# EAGLE schematic Dash (EAGLE 9.1.1)
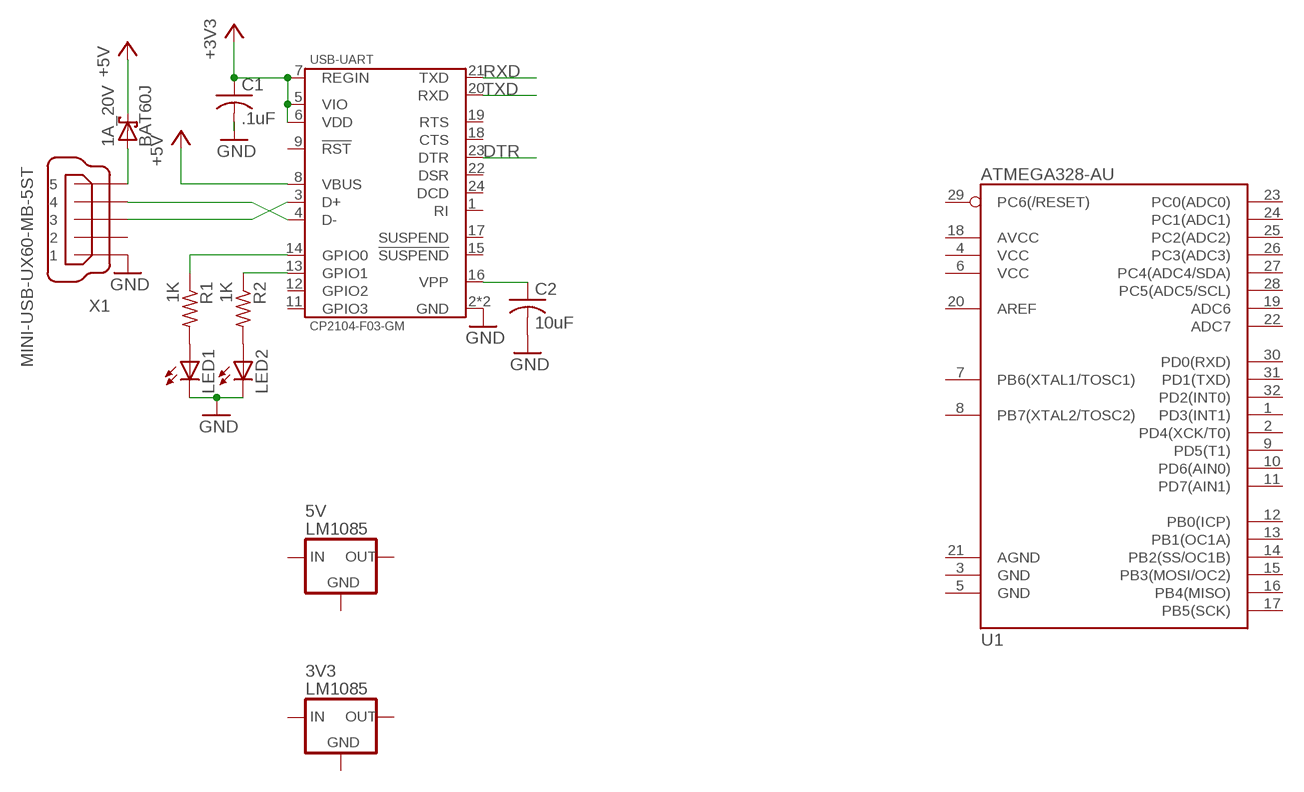
[diagram p0: schematic, sheet 1]

## Parts
1A_20V  BAT60J  [SOD323_ST]
3V3  LM1085  [TO-263]
5V  LM1085  [TO-263]
C1  .1uF  C-USC1206  [C1206]
C2  10uF  C-USC1206  [C1206]
LED1  LEDCHIPLED_1206  [CHIPLED_1206]
LED2  LEDCHIPLED_1206  [CHIPLED_1206]
R1  1K  R-US_R1206  [R1206]
R2  1K  R-US_R1206  [R1206]
U1  ATMEGA328-AU  [TQFP-32]
USB-UART  CP2104-F03-GM  [QFN-24-4X4]
X1  MINI-USB-UX60-MB-5ST  [UX60-MB-5ST]

## Nets
+3V3: C1.1 USB-UART.5(VIO) USB-UART.6(VDD) USB-UART.7(REGIN)
+5V: 1A_20V.C USB-UART.8(VBUS)
DTR: USB-UART.23(DTR)
GND: C1.2 C2.2 LED1.C LED2.C USB-UART.2(GND) USB-UART.PAD(GND) X1.1
N$1: USB-UART.4(D-) X1.4
N$2: USB-UART.3(D+) X1.3
N$3: 1A_20V.A X1.5
N$4: C2.1 USB-UART.16(VPP)
N$5: LED1.A R1.2
N$6: LED2.A R2.2
N$7: R2.1 USB-UART.13(GPIO1)
N$8: R1.1 USB-UART.14(GPIO0)
RXD: USB-UART.21(TXD)
TXD: USB-UART.20(RXD)
Unconnected: 3V3.1(GND) 3V3.2(OUT) 3V3.3(IN) 3V3.4(OUT) 5V.1(GND) 5V.2(OUT) 5V.3(IN) 5V.4(OUT) U1.1(PD3(INT1)) U1.2(PD4(XCK/T0)) U1.3(GND) U1.4(VCC) U1.5(GND) U1.6(VCC) U1.7(PB6(XTAL1/TOSC1)) U1.8(PB7(XTAL2/TOSC2)) U1.9(PD5(T1)) U1.10(PD6(AIN0)) U1.11(PD7(AIN1)) U1.12(PB0(ICP)) U1.13(PB1(OC1A)) U1.14(PB2(SS/OC1B)) U1.15(PB3(MOSI/OC2)) U1.16(PB4(MISO)) U1.17(PB5(SCK)) U1.18(AVCC) U1.19(ADC6) U1.20(AREF) U1.21(AGND) U1.22(ADC7) U1.23(PC0(ADC0)) U1.24(PC1(ADC1)) U1.25(PC2(ADC2)) U1.26(PC3(ADC3)) U1.27(PC4(ADC4/SDA)) U1.28(PC5(ADC5/SCL)) U1.29(PC6(/RESET)) U1.30(PD0(RXD)) U1.31(PD1(TXD)) U1.32(PD2(INT0)) USB-UART.1(RI) USB-UART.9(!RST) USB-UART.11(GPIO3) USB-UART.12(GPIO2) USB-UART.15(!SUSPEND) USB-UART.17(SUSPEND) USB-UART.18(CTS) USB-UART.19(RTS) USB-UART.22(DSR) USB-UART.24(DCD) X1.2

## Library data of the parts
1A_20V = diode:BAT60J: Schottky barrier diode Source: www.st.com, BAT60J.pdf
3V3 5V = work:LM1085: LM1085ISX-3.3/NOPB DigiKey: LM1085ISX-3.3/NOPBCT-ND
C1 C2 = resistor:C-US: CAPACITOR, American symbol
LED1 LED2 = led:LED: LED OSRAM: - CHIPLED LG R971, LG N971, LY N971, LG Q971, LY Q971, LO R971, LY R971 LH N974, LH R974 LS Q976, LO Q976, LY Q976 LO Q996 - Hyper CHIPLED LW Q18S LB Q993, LB Q99A, LB R99A - SideLED LS A670, LO A670, LY A670, LG A670, LP A670 LB A673, LV A673, LT A673, LW A673 LH A674 LY A675 LS A676, LA A676, LO A676, LY A676, LW A676 LS A679, LY A679, LG A679 - Hyper Micro SIDELED® LS Y876, LA Y876, LO Y876, LY Y876 LT Y87S - SmartLED LW L88C, LW L88S LB L89C, LB L89S, LG L890 LS L89K, LO L89K, LY L89K LS L896, LA L896, LO L896, LY L896 - TOPLED LS T670, LO T670, LY T670, LG T670, LP T670 LSG T670, LSP T670, LSY T670, LOP T670, LYG T670 LG T671, LOG T671, LSG T671 LB T673, LV T673, LT T673, LW T673 LH T674 LS T676, LA T676, LO T676, LY T676, LB T676, LH T676, LSB T676, LW T676 LB T67C, LV T67C, LT T67C, LS T67K, LO T67K, LY T67K, LW E67C LS E67B, LA E67B, LO E67B, LY E67B, LB E67C, LV E67C, LT E67C LW T67C LS T679, LY T679, LG T679 LS T770, LO T770, LY T770, LG T770, LP T770 LB T773, LV T773, LT T773, LW T773 LH T774 LS E675, LA E675, LY E675, LS T675 LS T776, LA T776, LO T776, LY T776, LB T776 LHGB T686 LT T68C, LB T68C - Hyper Mini TOPLED® LB M676 - Mini TOPLED Santana® LG M470 LS M47K, LO M47K, LY M47K Source: http://www.osram.convergy.de LUXEON: - LUMILED® LXK2-PW12-R00, LXK2-PW12-S00, LXK2-PW14-U00, LXK2-PW14-V00 LXK2-PM12-R00, LXK2-PM12-S00, LXK2-PM14-U00 LXK2-PE12-Q00, LXK2-PE12-R00, LXK2-PE12-S00, LXK2-PE14-T00, LXK2-PE14-U00 LXK2-PB12-K00, LXK2-PB12-L00, LXK2-PB12-M00, LXK2-PB14-N00, LXK2-PB14-P00, LXK2-PB14-Q00 LXK2-PR12-L00, LXK2-PR12-M00, LXK2-PR14-Q00, LXK2-PR14-R00 LXK2-PD12-Q00, LXK2-PD12-R00, LXK2-PD12-S00 LXK2-PH12-R00, LXK2-PH12-S00 LXK2-PL12-P00, LXK2-PL12-Q00, LXK2-PL12-R00 Source: www.luxeon.com KINGBRIGHT: KA-3528ASYC Source: www.kingbright.com
R1 R2 = resistor:R-US_: RESISTOR, American symbol
U1 = Atmel:ATMEGA328
USB-UART = Silicon Labs:CP2104
X1 = con-hirose:MINI-USB-: MINI USB Connector Source: http://www.hirose.co.jp/cataloge_hp/e24000019.pdf; OC_FARNELL: unknown; OC_NEWARK: unknown